# EAGLE design CANBUS_USB_TEENSY_41 (EAGLE 9.7.0)
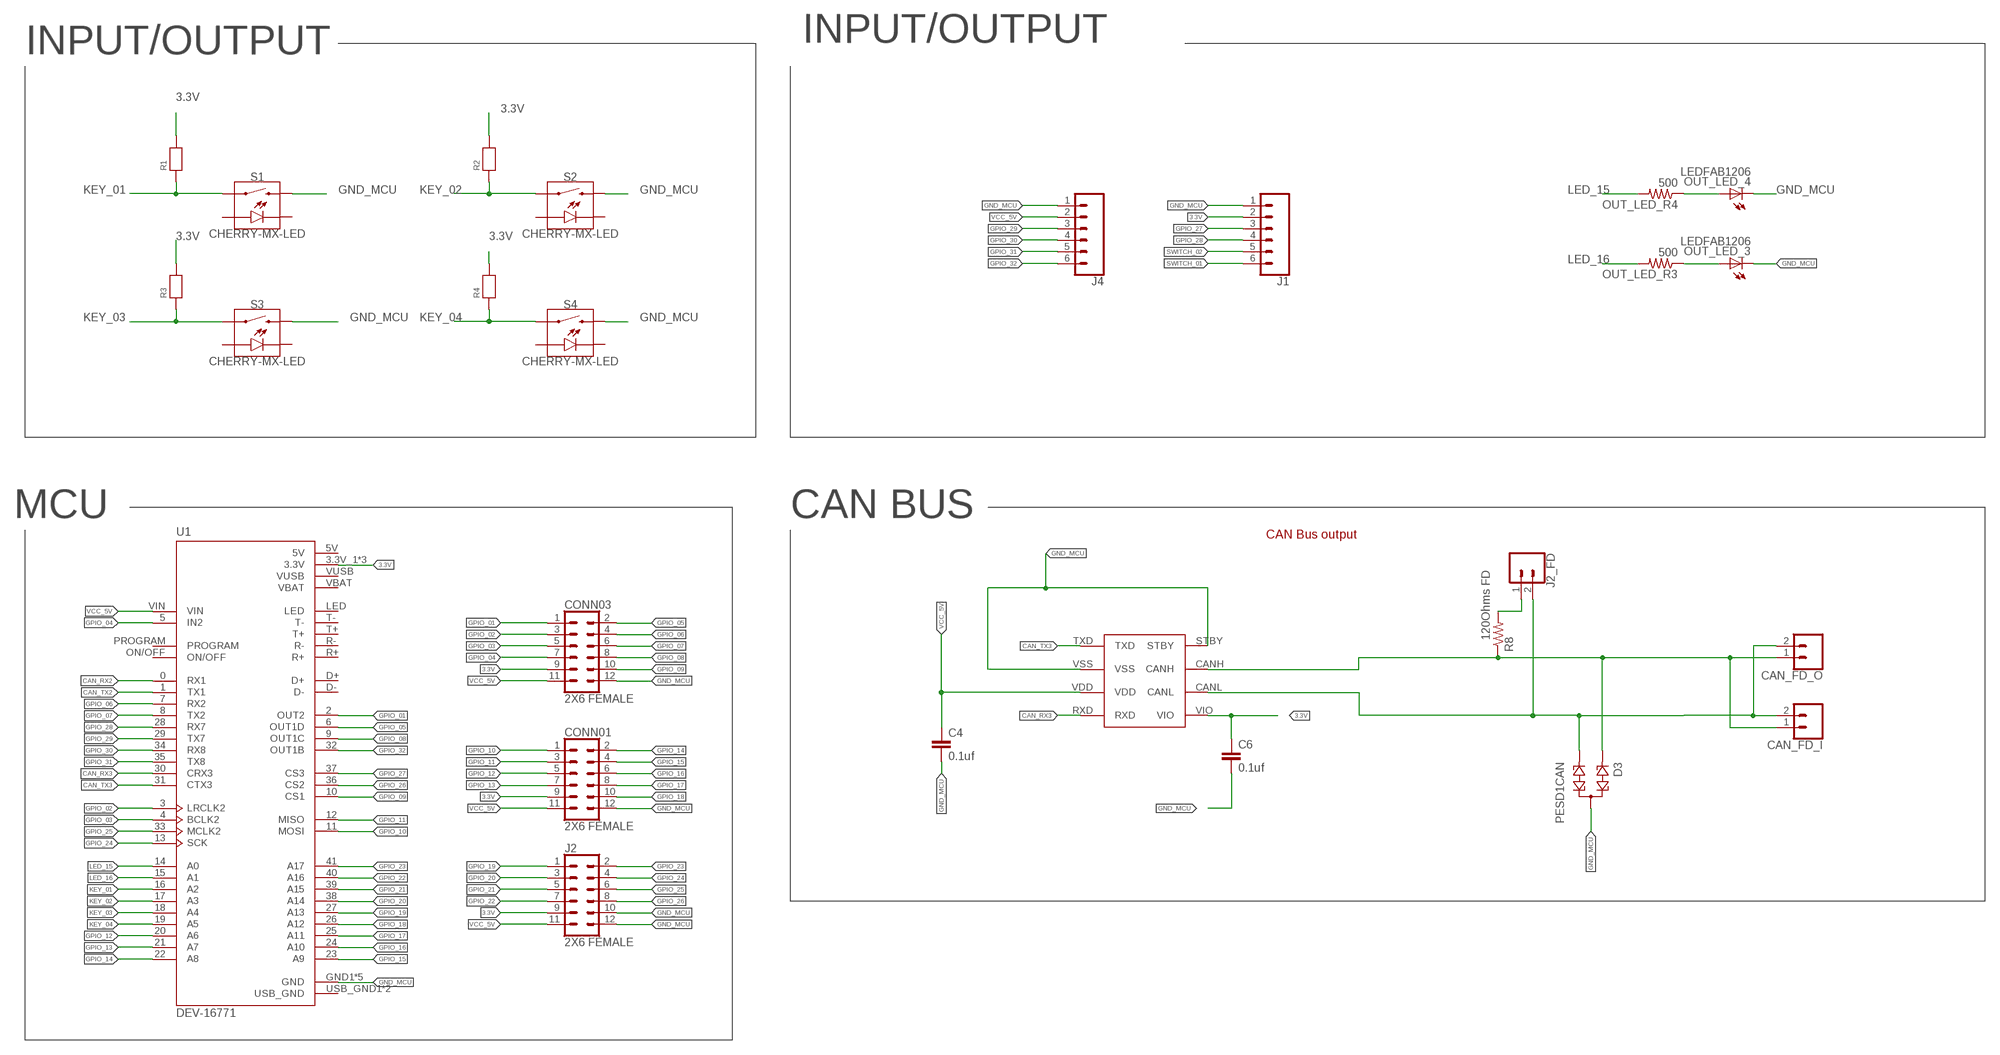
[diagram p0: schematic, sheet 1, part 1 of 2]
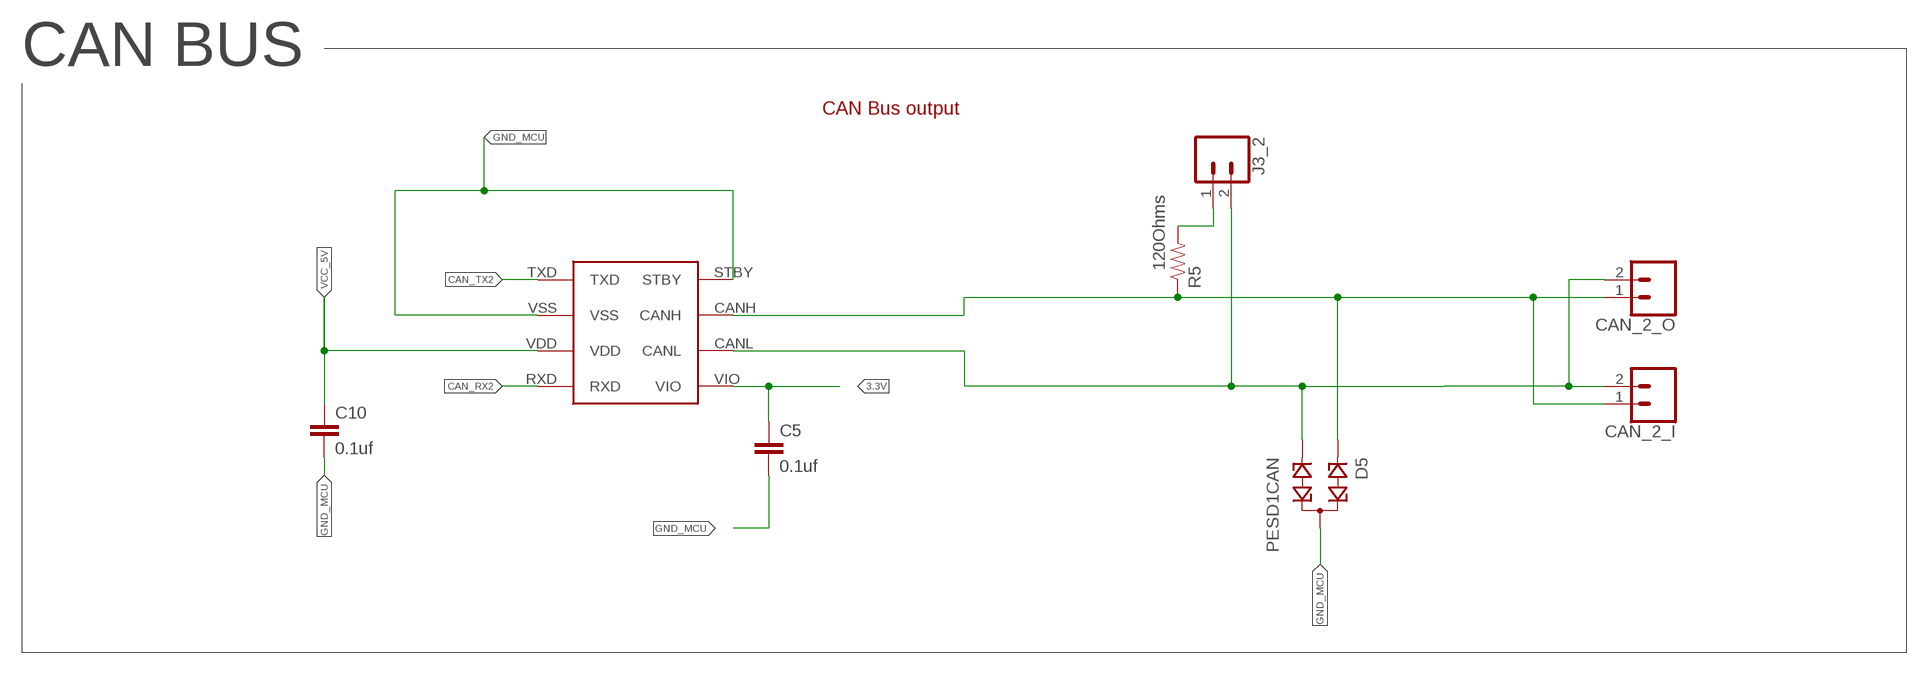
[diagram p1: schematic, sheet 1, part 2 of 2]

## Parts
C4  0.1uf  0.1UF-25V(+80/-20%)(0603)  [0603-CAP]
C5  0.1uf  0.1UF-25V(+80/-20%)(0603)  [0603-CAP]
C6  0.1uf  0.1UF-25V(+80/-20%)(0603)  [0603-CAP]
C10  0.1uf  0.1UF-25V(+80/-20%)(0603)  [0603-CAP]
CAN_2_I  CONN_02-JST-2MM-SMT  [JST-2-SMD]
CAN_2_O  CONN_02-JST-2MM-SMT  [JST-2-SMD]
CAN_FD_I  CONN_02-JST-2MM-SMT  [JST-2-SMD]
CAN_FD_O  CONN_02-JST-2MM-SMT  [JST-2-SMD]
CONN01  2X6 FEMALE  CONN_06X2PTH_FEMALE  [2X6]
CONN03  2X6 FEMALE  CONN_06X2PTH_FEMALE  [2X6]
D3  PESD1CAN  [SOT23]
D5  PESD1CAN  [SOT23]
J1  CONN_06SMD-1MM  [1X06-1MM]
J2  2X6 FEMALE  CONN_06X2PTH_FEMALE  [2X6]
J2_FD  CONN_02  [1X02]
J3_2  CONN_02  [1X02]
J4  CONN_06SMD-1MM  [1X06-1MM]
MCP2562  MCP2562  [MCP2562]
MCP2562FD  MCP2562  [MCP2562]
OUT_LED_3  LEDFAB1206  [LED1206FAB]
OUT_LED_4  LEDFAB1206  [LED1206FAB]
OUT_LED_R3  500  RES-US1206FAB  [R1206FAB]
OUT_LED_R4  500  RES-US1206FAB  [R1206FAB]
R1  RESISTOR1206  [1206]
R2  RESISTOR1206  [1206]
R3  RESISTOR1206  [1206]
R4  RESISTOR1206  [1206]
R5  120Ohms  10KOHM-1/10W-1%(0603)0603  [0603-RES]
R8  120Ohms FD  10KOHM-1/10W-1%(0603)0603  [0603-RES]
S1  CHERRY-MX-LED  [CHERRY-MX-LED]
S2  CHERRY-MX-LED  [CHERRY-MX-LED]
S3  CHERRY-MX-LED  [CHERRY-MX-LED]
S4  CHERRY-MX-LED  [CHERRY-MX-LED]
U1  DEV-16771  [MODULE_DEV-16771]

## Nets
3.3V: C5.1 C6.1 CONN01.9 CONN03.9 J1.2 J2.9 MCP2562.VIO MCP2562FD.VIO R1.2 R2.2 R3.2 R4.2 U1.3.3V_1(3.3V) U1.3.3V_2(3.3V) U1.3.3V_3(3.3V)
CAN_H: CAN_FD_I.1 CAN_FD_O.1 D3.1 MCP2562FD.CANH R8.1
CAN_H1: CAN_2_I.1 CAN_2_O.1 D5.1 MCP2562.CANH R5.1
CAN_L: CAN_FD_I.2 CAN_FD_O.2 D3.2 J2_FD.2 MCP2562FD.CANL
CAN_L1: CAN_2_I.2 CAN_2_O.2 D5.2 J3_2.2 MCP2562.CANL
CAN_RX2: MCP2562.RXD U1.0(RX1)
CAN_RX3: MCP2562FD.RXD U1.30(CRX3)
CAN_TX2: MCP2562.TXD U1.1(TX1)
CAN_TX3: MCP2562FD.TXD U1.31(CTX3)
GND_MCU: C4.2 C5.2 C6.2 C10.2 CONN01.12 CONN03.12 D3.3 D5.3 J1.1 J2.10 J2.12 J4.1 MCP2562.STBY MCP2562.VSS MCP2562FD.STBY MCP2562FD.VSS OUT_LED_3.2(C) OUT_LED_4.2(C) S1.S2 S2.S2 S3.S2 S4.S2 U1.GND1(GND) U1.GND2(GND) U1.GND3(GND) U1.GND4(GND) U1.GND5(GND)
GPIO_01: CONN03.1 U1.2(OUT2)
GPIO_02: CONN03.3 U1.3(LRCLK2)
GPIO_03: CONN03.5 U1.4(BCLK2)
GPIO_04: CONN03.7 U1.5(IN2)
GPIO_05: CONN03.2 U1.6(OUT1D)
GPIO_06: CONN03.4 U1.7(RX2)
GPIO_07: CONN03.6 U1.8(TX2)
GPIO_08: CONN03.8 U1.9(OUT1C)
GPIO_09: CONN03.10 U1.10(CS1)
GPIO_10: CONN01.1 U1.11(MOSI)
GPIO_11: CONN01.3 U1.12(MISO)
GPIO_12: CONN01.5 U1.20(A6)
GPIO_13: CONN01.7 U1.21(A7)
GPIO_14: CONN01.2 U1.22(A8)
GPIO_15: CONN01.4 U1.23(A9)
GPIO_16: CONN01.6 U1.24(A10)
GPIO_17: CONN01.8 U1.25(A11)
GPIO_18: CONN01.10 U1.26(A12)
GPIO_19: J2.1 U1.27(A13)
GPIO_20: J2.3 U1.38(A14)
GPIO_21: J2.5 U1.39(A15)
GPIO_22: J2.7 U1.40(A16)
GPIO_23: J2.2 U1.41(A17)
GPIO_24: J2.4 U1.13(SCK)
GPIO_25: J2.6 U1.33(MCLK2)
GPIO_26: J2.8 U1.36(CS2)
GPIO_27: J1.3 U1.37(CS3)
GPIO_28: J1.4 U1.28(RX7)
GPIO_29: J4.3 U1.29(TX7)
GPIO_30: J4.4 U1.34(RX8)
GPIO_31: J4.5 U1.35(TX8)
GPIO_32: J4.6 U1.32(OUT1B)
KEY_01: R1.1 S1.S1 U1.16(A2)
KEY_02: R2.1 S2.S1 U1.17(A3)
KEY_03: R3.1 S3.S1 U1.18(A4)
KEY_04: R4.1 S4.S1 U1.19(A5)
LED_15: OUT_LED_R4.2 U1.14(A0)
LED_16: OUT_LED_R3.2 U1.15(A1)
N$2: J2_FD.1 R8.2
N$5: J3_2.1 R5.2
N$6: OUT_LED_3.1(A) OUT_LED_R3.1
N$7: OUT_LED_4.1(A) OUT_LED_R4.1
SWITCH_01: J1.6
SWITCH_02: J1.5
VCC_5V [vcc5]: C4.1 C10.1 CONN01.11 CONN03.11 J2.11 J4.2 MCP2562.VDD MCP2562FD.VDD U1.VIN
Unconnected: S1.A S1.K(C) S2.A S2.K(C) S3.A S3.K(C) S4.A S4.K(C) U1.D+ U1.D- U1.LED U1.ON/OFF U1.PROGRAM U1.R+ U1.R- U1.T+ U1.T- U1.VBAT U1.VUSB

## Notes on the sheet
- INPUT/OUTPUT | INPUT/OUTPUT
- MCU | CAN BUS | CAN BUS
- CAN Bus output
- CAN Bus output

## Power pins joined to a net without a drawn wire
5V: U1.5V
USB_GND: U1.USB_GND1(USB_GND) U1.USB_GND2(USB_GND)

## Library data of the parts
C4-C6 C10 = SparkFun-Capacitors:0.1UF-25V(+80/-20%)(0603): CAP-00810 Ceramic Standard decoupling cap; PROD_ID: CAP-00810; VALUE: 0.1uF
CAN_2_I CAN_2_O CAN_FD_I CAN_FD_O = SparkFun-Connectors:CONN_02: Multi connection point. Often used as Generic Header-pin footprint for 0.1 inch spaced/style header connections On any of the 0.1 inch spaced packages, you can populate with these: Break Away Headers - Straight <https://www.sparkfun.com/products/116> (PRT-00116) Break Away Male Headers - Right Angle <https://www.sparkfun.com/products/553> (PRT-00553) Female Headers <https://www.sparkfun.com/products/115> (PRT-00115) Break Away Headers - Machine Pin <https://www.sparkfun.com/products/117> (PRT-00117) Break Away Female Headers - Swiss Machine Pin <https://www.sparkfun.com/products/743> (PRT-00743) For SCREWTERMINALS and SPRING TERMINALS visit here: Screw Terimnals on SparkFun.com <https://www.sparkfun.com/search/results?term=Screw+Terminals> (5mm/3.5mm/2.54mm spacing) This device is also useful as a general connection point to wire up your design to another part of your project. Our various solder wires solder well into these plated through hole pads. Hook-Up Wire - Assortment (Stranded, 22 AWG) <https://www.sparkfun.com/products/11375> (PRT-11375) Hook-Up Wire - Assortment (Solid Core, 22 AWG) <https://www.sparkfun.com/products/11367> (PRT-11367) View the entire wire category on our website here <https://www.sparkfun.com/categories/141> Special notes: Molex polarized connector foot print use with: PRT-08233 with associated crimp pins and housings. 2.54_SCREWTERM for use with PRT-10571. 3.5mm Screw Terminal footprints for PRT-08084 5mm Screw Terminal footprints for use with PRT-08432; PROD_ID: CONN-11443
CONN01 CONN03 J2 = SparkFun-Connectors:CONN_06X2: Multi connection point. Often used as Generic Header-pin footprint for 0.1 inch spaced/style header connections On any of the 0.1 inch spaced packages, you can populate with these: Break Away Headers - Straight <https://www.sparkfun.com/products/116> (PRT-00116) Break Away Male Headers - Right Angle <https://www.sparkfun.com/products/553> (PRT-00553) Female Headers <https://www.sparkfun.com/products/115> (PRT-00115) Break Away Headers - Machine Pin <https://www.sparkfun.com/products/117> (PRT-00117) Break Away Female Headers - Swiss Machine Pin <https://www.sparkfun.com/products/743> (PRT-00743); PROD_ID: CONN-12423
D3 D5 = diode:PESD1CAN: CAN bus ESD protection diode Source: http://www.nxp.com/documents/data_sheet/PESD1CAN.pdf
J1 J4 = SparkFun-Connectors:CONN_06: Multi connection point. Often used as Generic Header-pin footprint for 0.1 inch spaced/style header connections On any of the 0.1 inch spaced packages, you can populate with these: Break Away Headers - Straight <https://www.sparkfun.com/products/116> (PRT-00116) Break Away Male Headers - Right Angle <https://www.sparkfun.com/products/553> (PRT-00553) Female Headers <https://www.sparkfun.com/products/115> (PRT-00115) Break Away Headers - Machine Pin <https://www.sparkfun.com/products/117> (PRT-00117) Break Away Female Headers - Swiss Machine Pin <https://www.sparkfun.com/products/743> (PRT-00743) Arduino Stackable Header - 6 Pin <https://www.sparkfun.com/products/9280> (PRT-09280) For SCREWTERMINALS and SPRING TERMINALS visit here: Screw Terimnals on SparkFun.com <https://www.sparkfun.com/search/results?term=Screw+Terminals> (5mm/3.5mm/2.54mm spacing) This device is also useful as a general connection point to wire up your design to another part of your project. Our various solder wires solder well into these plated through hole pads. Hook-Up Wire - Assortment (Stranded, 22 AWG) <https://www.sparkfun.com/products/11375> (PRT-11375) Hook-Up Wire - Assortment (Solid Core, 22 AWG) <https://www.sparkfun.com/products/11367> (PRT-11367) View the entire wire category on our website here <https://www.sparkfun.com/categories/141>; PROD_ID: CONN-08249; SF_ID: GPS-00579
J2_FD J3_2 = SparkFun-Connectors:CONN_02: Multi connection point. Often used as Generic Header-pin footprint for 0.1 inch spaced/style header connections On any of the 0.1 inch spaced packages, you can populate with these: Break Away Headers - Straight <https://www.sparkfun.com/products/116> (PRT-00116) Break Away Male Headers - Right Angle <https://www.sparkfun.com/products/553> (PRT-00553) Female Headers <https://www.sparkfun.com/products/115> (PRT-00115) Break Away Headers - Machine Pin <https://www.sparkfun.com/products/117> (PRT-00117) Break Away Female Headers - Swiss Machine Pin <https://www.sparkfun.com/products/743> (PRT-00743) For SCREWTERMINALS and SPRING TERMINALS visit here: Screw Terimnals on SparkFun.com <https://www.sparkfun.com/search/results?term=Screw+Terminals> (5mm/3.5mm/2.54mm spacing) This device is also useful as a general connection point to wire up your design to another part of your project. Our various solder wires solder well into these plated through hole pads. Hook-Up Wire - Assortment (Stranded, 22 AWG) <https://www.sparkfun.com/products/11375> (PRT-11375) Hook-Up Wire - Assortment (Solid Core, 22 AWG) <https://www.sparkfun.com/products/11367> (PRT-11367) View the entire wire category on our website here <https://www.sparkfun.com/categories/141> Special notes: Molex polarized connector foot print use with: PRT-08233 with associated crimp pins and housings. 2.54_SCREWTERM for use with PRT-10571. 3.5mm Screw Terminal footprints for PRT-08084 5mm Screw Terminal footprints for use with PRT-08432
MCP2562 MCP2562FD = MCP2562:MCP2562
OUT_LED_3 OUT_LED_4 = fab:LED: LED
OUT_LED_R3 OUT_LED_R4 = fab:RES-US: Resistor (US Symbol) Variants with postfix FAB are widened to allow the routing of internal traces
R1-R4 = microbuilder:RESISTOR: Resistors 0402 - 0402 Surface Mount Package 22 Ohm 1% 1/16W [Digikey: 311-22.0LRTR-ND] 33 Ohm 5% 1/16W 1.0K 5% 1/16W 1.5K 5% 1/16W 2.0K 1% 1/16W 10.0K 1% 1/16W [Digikey: 311-10.0KLRTR-ND] 10.0K 5% 1/16W [Digikey: RMCF0402JT10K0TR-ND] 12.1K 1% 1/16W [Digikey: 311-22.0LRTR-ND] 100.0K 5% 1/16W 0603 - 0603 Surface Mount Package 0 Ohm 1/10 Watt 1% Resistor 15 Ohm 1/10 Watt 1% Resistor 33 Ohm 1/10 Watt 1% Resistor 49.9 Ohm 1/10 Watt 1% Resistor 100 Ohm 1/10 Watt 1% Resistor 150 Ohm 1/10 Watt 1% Resistor 240 Ohm 1/10 Watt 1% Resistor 390 Ohm 1/10 Watt 1% Resistor 560 Ohm 1/10 Watt 1% Resistor 680 Ohm 1/10 Watt 1% Resistor 750 Ohm 1/10 Watt 1% Resistor 1.0K Ohm 1/10 Watt 1% Resistor 1.5K Ohm 1/10 Watt 1% Resistor 2.0K Ohm 1/10 Watt 1% Resistor 2.2K Ohm 1/10 Watt 1% Resistor 3.3K Ohm 1/10 Watt 1% Resistor 4.7K Ohm 1/10 Watt 1% Resistor 10.0K Ohm 1/10 Watt 1% Resistor 12.0K Ohm 1/10 Watt 1% Resistor 12.1K Ohm 1/10 Watt 1% Resistor 20.0K Ohm 1/10 Watt 1% Resistor 33.0K Ohm 1/10 Watt 1% Resistor 100.0K Ohm 1/10 Watt 1% Resistor 0805 - 0805 Surface Mount Package 0 Ohm 1/8 Watt 1% Resistor 33 Ohm 1/8 Watt 1% Resistor 100 Ohm 1/8 Watt 1% Resistor 150 Ohm 1/8 Watt 1% Resistor 200 Ohm 1/8 Watt 1% Resistor 240 Ohm 1/8 Watt 1% Resistor 330 Ohm 1/8 Watt 1% Resistor 390 Ohm 1/8 Watt 1% Resistor 470 Ohm 1/8 Watt 1% Resistor 1.0K Ohm 1/8 Watt 1% Resistor 1.5K Ohm 1/8 Watt 1% Resistor 2.0K Ohm 1/8 Watt 1% Resistor 4.7K Ohm 1/8 Watt 1% Resistor 5.1K Ohm 1/8 Watt 1% Resistor 5.6K Ohm 1/8 Watt 1% Resistor 10.0K Ohm 1/8 Watt 1% Resistor 22.0K Ohm 1/8 Watt 1% Resistor 33.0K Ohm 1/8 Watt 1% Resistor 100K Ohm 1/8 Watt 1% Resistor 1206 - 1206 Surface Mount Package 2012 - 2010 Surface Mount Package 0.11 Ohm 1/2 Watt 1% Resistor - Digikey: RHM.11UCT-ND
R5 R8 = SparkFun-Resistors:10KOHM-1/10W-1%(0603): RES-00824; PROD_ID: RES-00824; VALUE: 10K
S1-S4 = cherry-temp:CHERRY-MX-LED
U1 = DEV-16771:DEV-16771: RT1062 Teensy 4.1 i.MX ARM Cortex-M7 MPU Embedded Evaluation Board Check availability <https://pricing.snapeda.com/parts/DEV-16771/SparkFun%20Electronics/view-part?ref=eda>; AVAILABILITY: In Stock; DESCRIPTION: RT1062 Teensy 4.1 series ARM® Cortex®-M7 MPU Embedded Evaluation Board; MF: SparkFun Electronics; MP: DEV-16771; PACKAGE: None; PRICE: None; PURCHASE-URL: https://pricing.snapeda.com/search?q=DEV-16771&ref=eda

## Net classes
0 default: width 0.2 mm, clearance 0.2 mm
1 gnd: width 0.2 mm, clearance 0.2 mm
3 vcc: width 0.35 mm, clearance 0.2 mm
4 vcc5: width 0.35 mm, clearance 0.2 mm

## Board
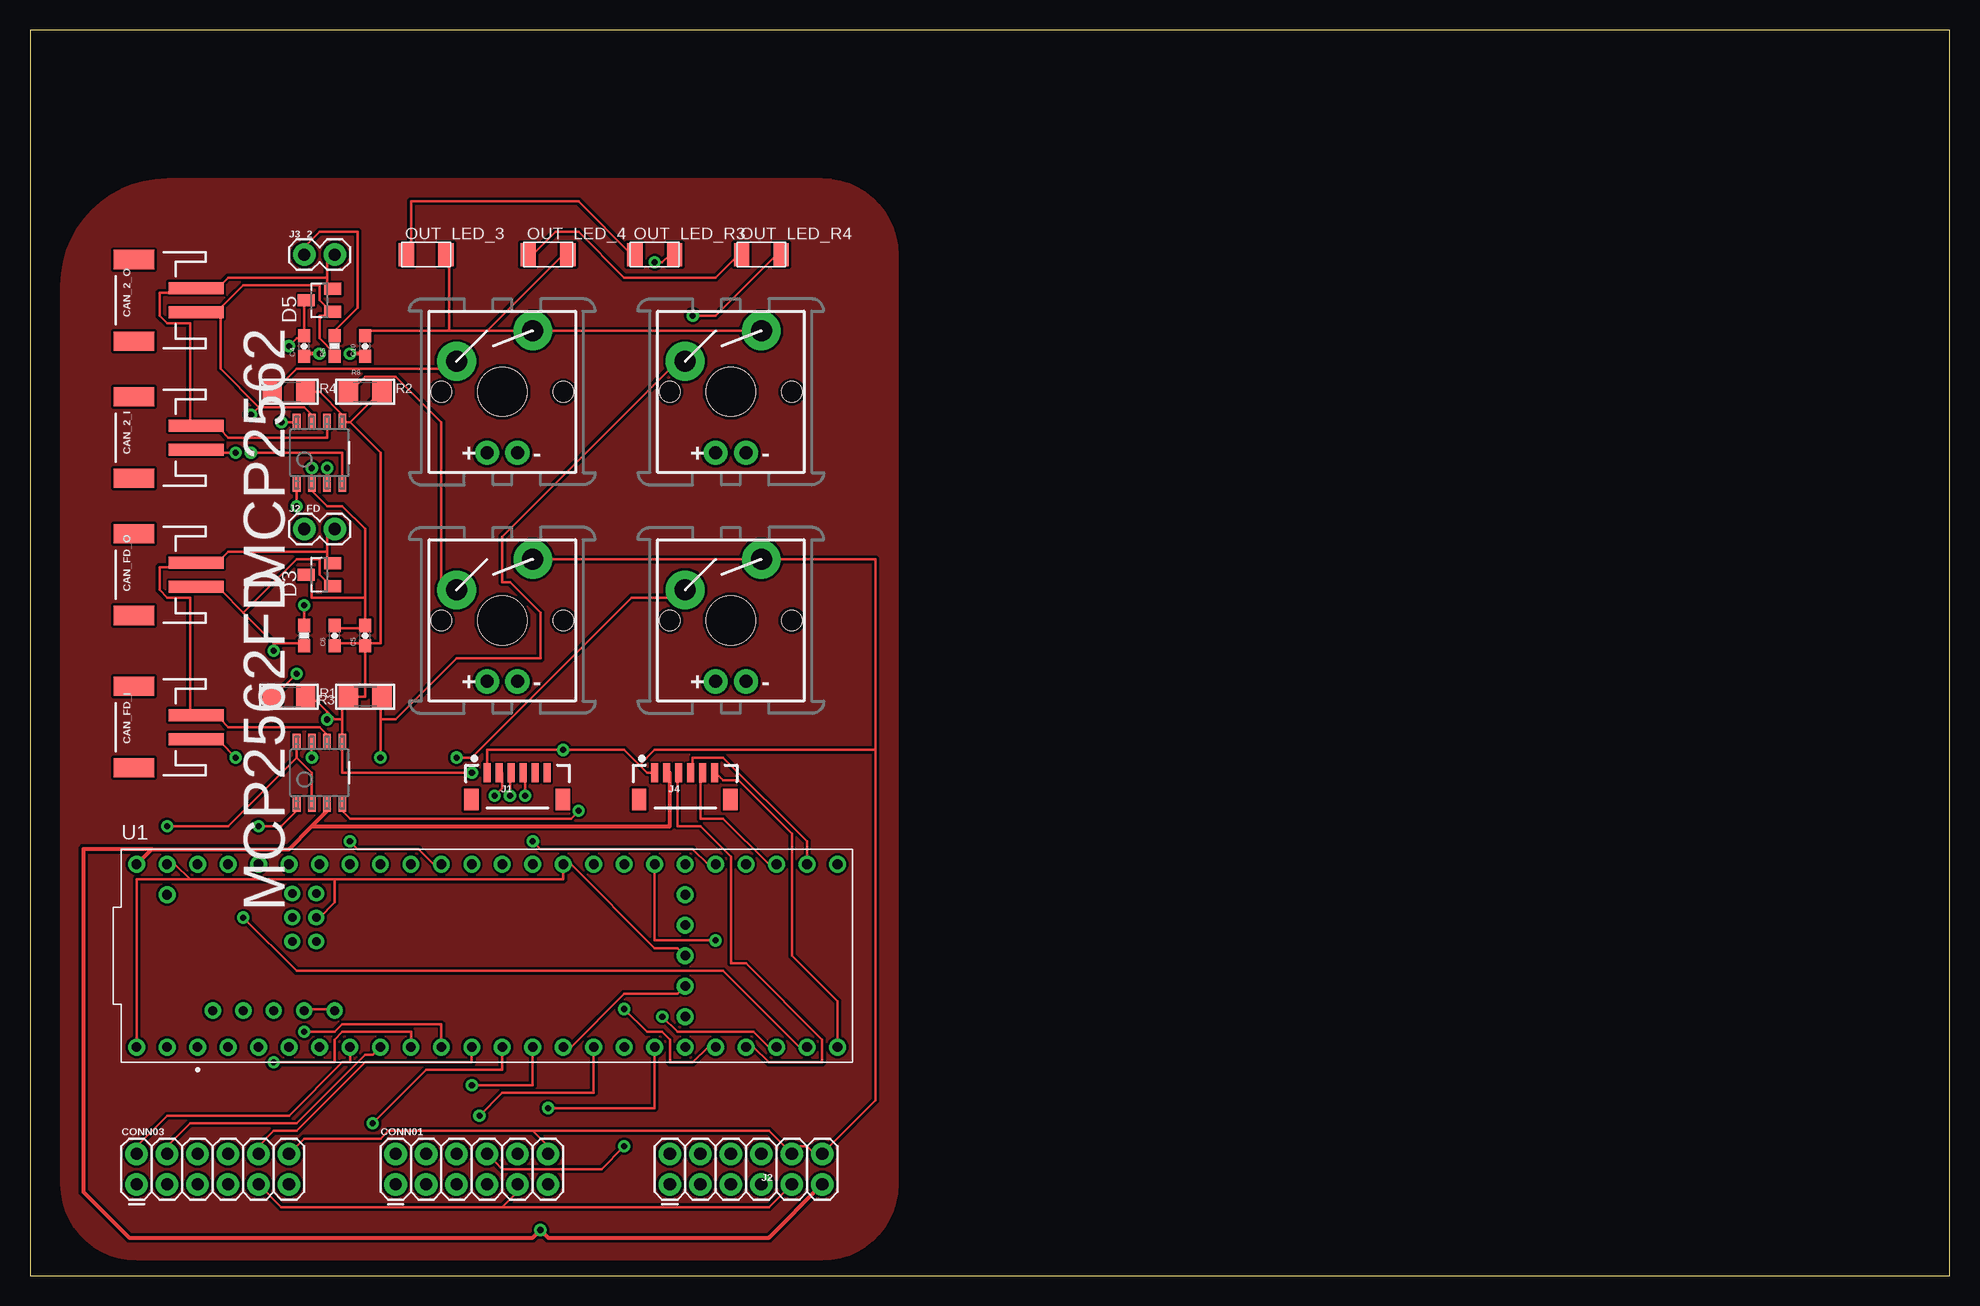
[diagram p2: board, top side]
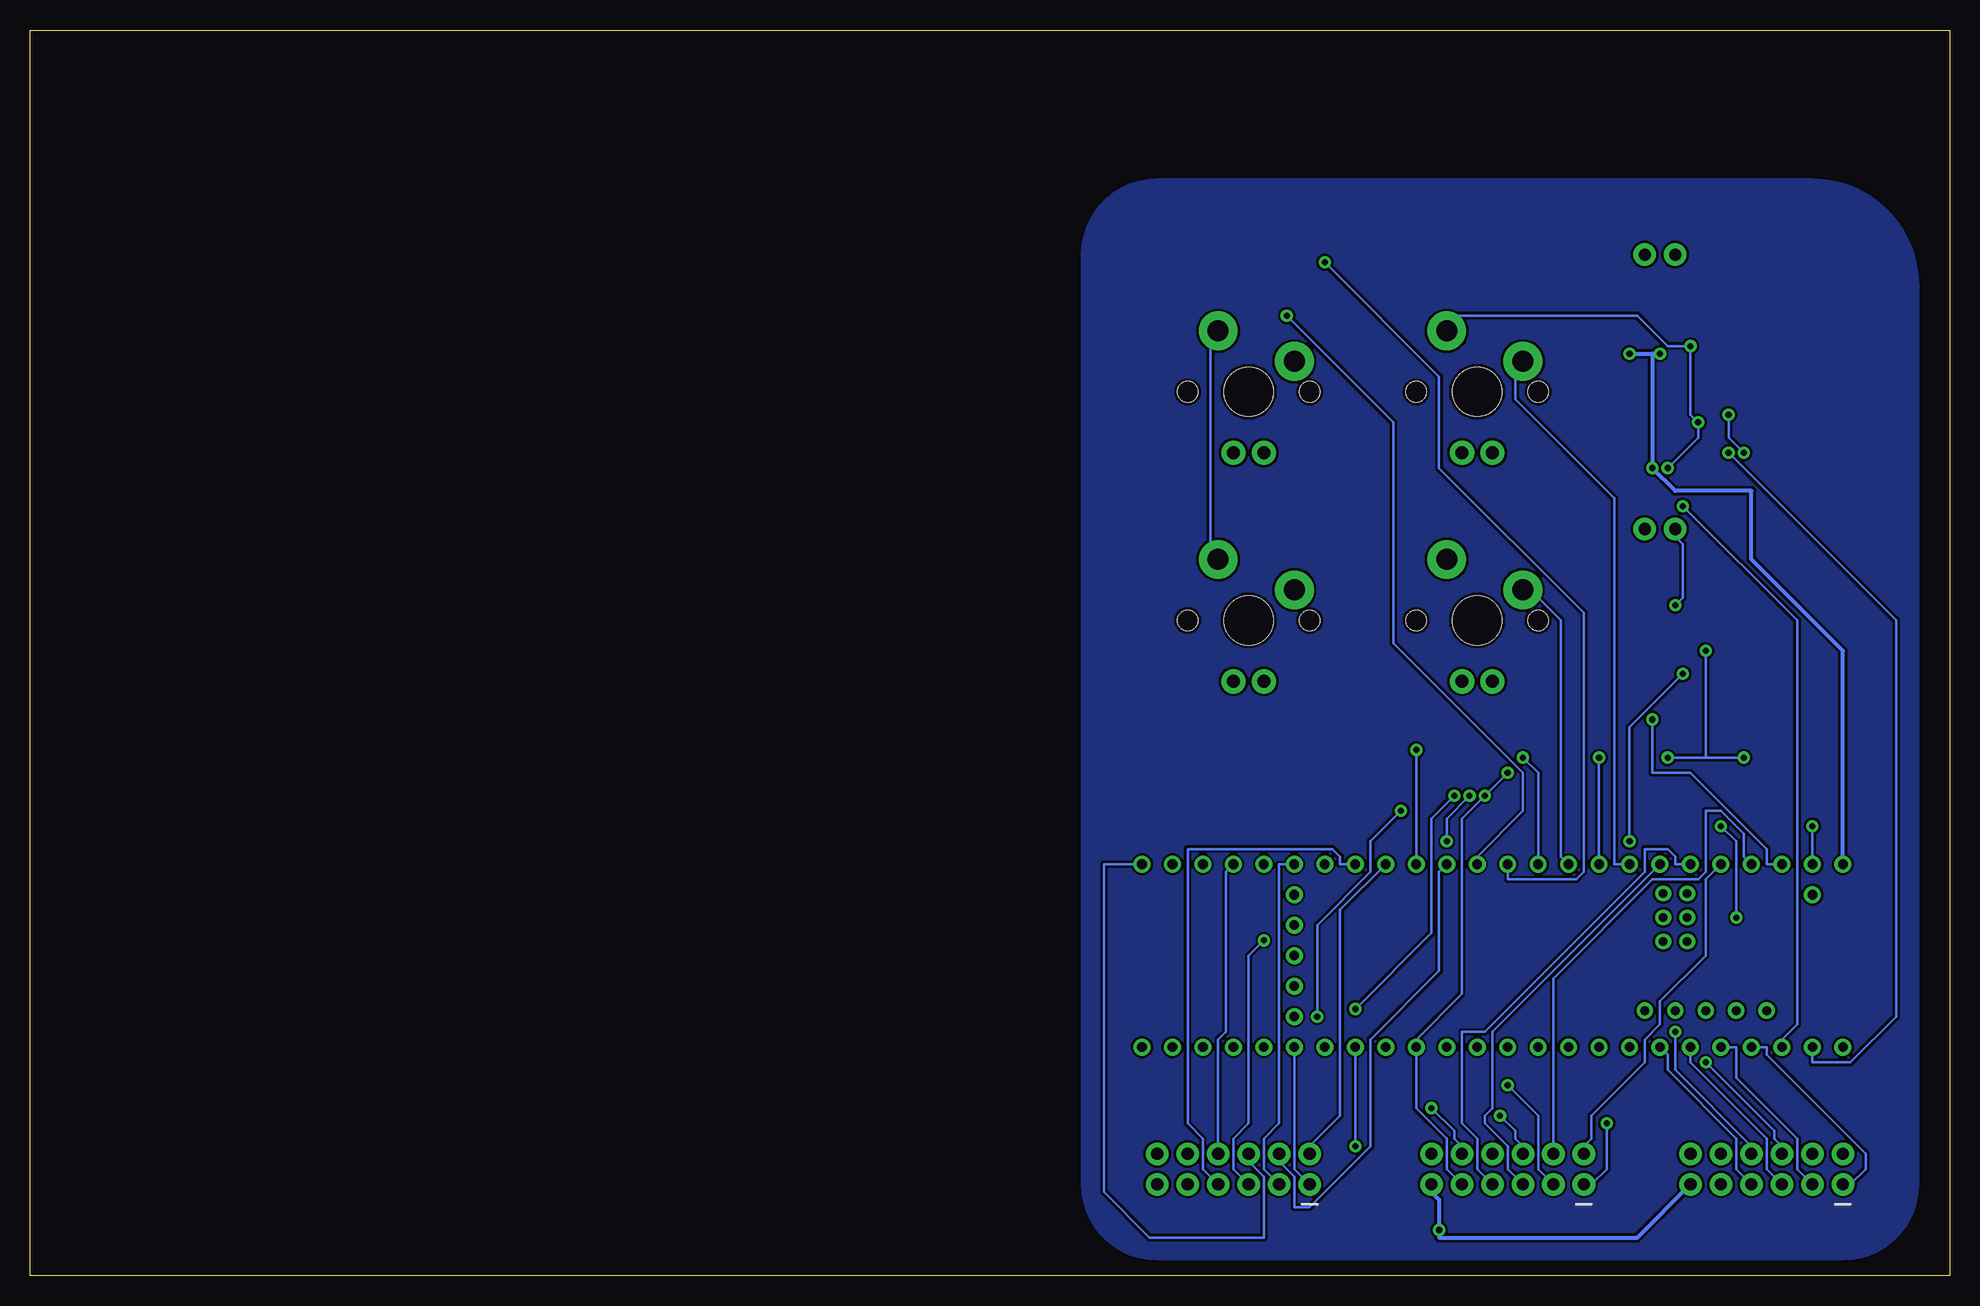
[diagram p3: board, bottom side, seen from below]

Size 160 x 103.81 mm. Coordinates in mm from the lower left corner, seen from the top.
Outline: 0,0 160,0 160,103.81 0,103.81 0,0
Copper layers (1*16): Top / Bottom
Stack-up Default Layer Stack: Top User Defined 0.035mm / Dielectric-1 User Defined 1.5mm / Bottom User Defined 0.035mm
Design rules "SparkFun": minimum track width 8mil, minimum drill 20mil, track to track 8mil, track to pad 8mil, pad to pad 8mil, via to via 8mil, smd to smd 8mil, copper to edge 10mil, drill to drill 8mil, minimum pad ring 12mil, minimum via ring 10mil, stop-mask expansion 4mil, vias tented up to drill 25mil, thermal gap 10mil

### Footprints (pad centres in the part's own frame; a part is rotated, then mirrored left to right if it is on the bottom)
0603-CAP = smd 1.1 x 1: 1 -0.85,0; 2 0.85,0
JST-2-SMD = smd 1 x 4.6: 1 -1,-3.7; 2 1,-3.7 | smd 1.6 x 3.4: NC1 -3.4,1.5; NC2 3.4,1.5
2X6 = drill 1.016 pad 1.88: 1 0,0; 2 0,2.54; 3 2.54,0; 4 2.54,2.54; 5 5.08,0; 6 5.08,2.54; 7 7.62,0; 8 7.62,2.54; 9 10.16,0; 10 10.16,2.54; 11 12.7,0; 12 12.7,2.54
SOT23 = smd 1 x 1.4: 1 -0.95,-1.1; 2 0.95,-1.1; 3 0,1.1
1X06-1MM = smd 0.6 x 1.55: 1 -2.54,1.27; 2 -1.54,1.27; 3 -0.54,1.27; 4 0.46,1.27; 5 1.46,1.27; 6 2.46,1.27 | smd 1.2 x 1.8: P$1 -3.84,-0.955; P$2 3.76,-0.955
1X02 = drill 1.016 pad 1.88: 1 0,0; 2 2.54,0
MCP2562 = smd 1.27 x 0.635: CANH 2.625,0.635; CANL 2.625,-0.635; RXD -2.625,-1.905; STBY 2.625,1.905; TXD -2.625,1.905; VDD -2.625,-0.635; VIO 2.625,-1.905; VSS -2.625,0.635
LED1206FAB = smd 1.27 x 1.905: 1 -1.651,0; 2 1.651,0
R1206FAB = smd 1.27 x 1.905: 1 -1.651,0; 2 1.651,0
1206 = smd 1.6 x 1.8: 1 -1.4,0; 2 1.4,0
0603-RES = smd 1.1 x 1: 1 -0.85,0; 2 0.85,0
CHERRY-MX-LED = drill 1.092 pad 2.032: A -1.27,-5.08; K 1.27,-5.08 | drill 1.753 pad 3.226: S1 -3.81,2.54; S2 2.54,5.08 | hole 4.089: 0,0 | hole 1.707: -5.08,0; 5.08,0
MODULE_DEV-16771 = drill 0.8: 0 -26.67,-7.62; 1 -24.13,-7.62; 2 -21.59,-7.62; 3 -19.05,-7.62; 3.3V_1 6.35,-7.62; 3.3V_2 -24.13,7.62; 3.3V_3 16.51,-2.54; 4 -16.51,-7.62; 5 -13.97,-7.62; 6 -11.43,-7.62; 7 -8.89,-7.62; 8 -6.35,-7.62; 9 -3.81,-7.62; 10 -1.27,-7.62; 11 1.27,-7.62; 12 3.81,-7.62; 13 3.81,7.62; 14 1.27,7.62; 15 -1.27,7.62; 16 -3.81,7.62; 17 -6.35,7.62; 18 -8.89,7.62; 19 -11.43,7.62; 20 -13.97,7.62; 21 -16.51,7.62; 22 -19.05,7.62; 23 -21.59,7.62; 24 8.89,-7.62; 25 11.43,-7.62; 26 13.97,-7.62; 27 16.51,-7.62; 28 19.05,-7.62; 29 21.59,-7.62; 30 24.13,-7.62; 31 26.67,-7.62; 32 29.21,-7.62; 33 29.21,7.62; 34 26.67,7.62; 35 24.13,7.62; 36 21.59,7.62; 37 19.05,7.62; 38 16.51,7.62; 39 13.97,7.62; 40 11.43,7.62; 41 8.89,7.62; GND1 -29.21,-7.62; GND2 6.35,7.62; GND3 -26.67,7.62; GND4 16.51,0; ON/OFF 16.51,5.08; PROGRAM 16.51,2.54; VBAT 16.51,-5.08; VIN -29.21,7.62; VUSB -26.67,5.08 | drill 0.75: 5V -22.86,-4.57; D+ -17.78,-4.57; D- -20.32,-4.57; USB_GND1 -15.24,-4.57; USB_GND2 -12.7,-4.57 | drill 0.7: GND5 -14.24,3.17; LED -16.24,3.17; R+ -16.24,5.17; R- -14.24,5.17; T+ -14.24,1.17; T- -16.24,1.17

### Placement (x,y rotation side)
C4  22.86,77.47 90 top
C5  27.94,53.34 90 top
C6  25.4,53.34 90 top
C10  27.94,77.47 90 top
CAN_2_I  10.16,69.85 90 top
CAN_2_O  10.16,81.28 90 top
CAN_FD_I  10.16,45.72 90 top
CAN_FD_O  10.16,58.42 90 top
CONN01  30.48,7.62 0 top
CONN03  8.89,7.62 0 top
D3  24.13,58.42 90 top
D5  24.13,81.28 90 top
J1  40.64,40.64 0 top
J2  53.34,7.62 0 top
J2_FD  22.86,62.23 0 top
J3_2  22.86,85.09 0 top
J4  54.61,40.64 0 top
MCP2562  24.13,68.58 90 top
MCP2562FD  24.13,41.91 90 top
OUT_LED_3  33.02,85.09 0 top
OUT_LED_4  43.18,85.09 0 top
OUT_LED_R3  52.07,85.09 0 top
OUT_LED_R4  60.96,85.09 0 top
R1  21.59,48.26 0 top
R2  27.94,73.66 0 top
R3  27.94,48.26 180 top
R4  21.59,73.66 0 top
R5  25.4,77.47 90 top
R8  22.86,53.34 90 top
S1  58.42,54.61 0 top
S2  39.37,54.61 0 top
S3  58.42,73.66 0 top
S4  39.37,73.66 0 top
U1  38.1,26.67 0 top

### Tracks (layer width: path | path; a pad name or v marks a point on that pad's centre or on a via)
3.3V  (via drill 0.51)
  Top 0.203: R4.2 23.49,73.66 24.13,73.66 26.04,71.76 MCP2562.VIO 26.04,71.12 26.67,71.12 | 26.67,71.12 29.21,73.66 R2.2 | 27.94,52.7 25.4,52.7 C6.1 | 27.94,52.7 C5.1 | 26.04,46.35 26.04,48.26 R3.2 26.67,48.26 27.94,48.26 27.94,52.07 C5.1 | 26.04,46.35 26.04,45.09 MCP2562FD.VIO 26.04,44.45 26.04,41.91 v36.83,41.91 | 24.76,46.99 25.4,46.35 26.04,46.35 | 24.76,46.99 23.49,48.26 R1.2 | 24.76,46.99 v24.76,46.35 | 26.67,71.12 29.21,68.58 29.21,52.7 27.94,52.7 | 27.94,52.7 C5.1 | v38.73,40.01 39.37,40.64 39.37,41.91 J1.2 | U1.3.3V_3 53.98,23.49 49.53,23.49 45.09,19.05 U1.3.3V_1 | CONN03.9 20.95,5.71 39.37,5.71 | 39.37,5.71 40.64,6.99 CONN01.9 | J2.9 61.59,5.71 39.37,5.71
  Bottom 0.203: U1.3.3V_2 15.24,34.29 15.24,35.56 21.59,41.91 24.76,41.91 v24.76,46.35 | CONN01.9 40.64,8.25 41.28,8.25 41.91,8.89 41.91,11.43 44.45,13.97 U1.3.3V_1 44.45,19.68 40.64,23.49 40.64,38.1 v38.73,40.01 v36.83,41.91
CAN_H  (via drill 0.51)
  Top 0.203: v23.49,43.18 23.49,44.45 MCP2562FD.CANH | v17.14,43.18 15.88,44.45 13.97,44.45 CAN_FD_I.1 | 20.32,52.7 22.86,52.7 R8.1 | 17.78,55.24 15.88,57.15 13.97,57.15 CAN_FD_O.1 | 17.78,55.24 20.32,52.7 | 17.78,55.24 22.22,59.69 24.13,59.69 24.13,58.42 24.76,57.78 D3.1 | 20.32,52.7 v20.32,52.07
  Bottom 0.203: v17.14,43.18 20.32,43.18 | 20.32,43.18 v23.49,43.18 | v20.32,52.07 20.32,43.18
CAN_H1  (via drill 0.51)
  Top 0.203: R5.1 25.4,76.84 24.13,78.11 24.13,80.01 24.76,80.01 D5.1 24.76,80.65 24.13,81.28 24.13,82.55 17.78,82.55 15.24,80.01 | 19.05,72.39 22.86,72.39 23.49,71.76 MCP2562.CANH | 19.05,72.39 15.88,75.57 15.88,80.01 15.24,80.01 | 15.24,80.01 13.97,80.01 CAN_2_O.1 15.24,80.01 | v17.14,68.58 13.97,68.58 CAN_2_I.1 | 19.05,72.39 v18.41,71.76
  Bottom 0.203: v17.14,68.58 18.41,69.85 v18.41,71.76
CAN_L
  Top 0.203: MCP2562FD.CANL 24.76,45.09 24.13,45.72 16.51,45.72 15.88,46.35 13.97,46.35 CAN_FD_I.2 13.34,46.99 13.34,56.52 11.43,56.52 10.79,57.15 10.79,59.05 13.34,59.05 CAN_FD_O.2 13.97,59.69 15.88,59.69 16.51,60.32 24.76,60.32 | 24.76,60.32 24.76,62.23 J2_FD.2 | 24.76,60.32 24.76,59.69 D3.2
CAN_L1
  Top 0.203: MCP2562.CANL 24.76,71.12 24.76,69.85 16.51,69.85 15.88,70.48 13.97,70.48 CAN_2_I.2 13.34,71.12 13.34,79.38 11.43,79.38 10.79,80.01 10.79,81.92 13.34,81.92 CAN_2_O.2 13.97,82.55 15.88,82.55 16.51,83.19 24.76,83.19 | 24.76,83.19 24.76,85.09 J3_2.2 | 24.76,83.19 24.76,82.55 D5.2
CAN_RX2  (via drill 0.51)
  Top 0.203: v18.41,68.58 26.04,68.58 26.04,66.04 MCP2562.RXD
  Bottom 0.203: v18.41,68.58 4.45,54.61 4.45,21.59 8.26,17.78 11.43,17.78 U1.0
CAN_RX3  (via drill 0.51)
  Top 0.203: v45.72,38.73 45.09,38.1 26.67,38.1 26.04,38.73 MCP2562FD.RXD | v52.71,21.59 53.98,20.32 60.33,20.32 61.59,19.05 U1.30
  Bottom 0.203: v45.72,38.73 48.26,36.2 48.26,33.66 52.71,29.21 v52.71,21.59
CAN_TX2  (via drill 0.51)
  Top 0.203: v22.22,64.14 22.22,65.41 MCP2562.TXD
  Bottom 0.203: v22.22,64.14 12.7,54.61 12.7,20.95 13.97,19.68 U1.1
CAN_TX3  (via drill 0.51)
  Top 0.203: v19.05,37.46 20.95,37.46 22.22,38.73 MCP2562FD.TXD | v17.78,29.84 22.22,25.4 57.79,25.4 64.14,19.05 U1.31
  Bottom 0.203: v19.05,37.46 17.78,36.2 v17.78,29.84
GND_MCU  (via drill 0.51)
  Top 0.203: J1.1 38.1,43.81 v44.45,43.81 49.53,43.81 50.8,42.55 | 50.8,42.55 51.44,41.91 J4.1 | U1.GND4 53.98,27.3 52.07,27.3 45.09,34.29 U1.GND2 44.45,33.02 25.4,33.02 | 22.22,43.18 23.49,41.91 23.49,39.37 MCP2562FD.VSS | 22.22,43.18 22.22,44.45 MCP2562FD.STBY | 25.4,33.02 25.4,31.11 24.13,29.84 U1.GND5 | 13.34,33.02 25.4,33.02 | 13.34,33.02 12.07,34.29 U1.GND3 | U1.GND1 8.89,33.02 13.34,33.02 | 22.22,43.18 16.51,37.46 v11.43,37.46 | CONN03.12 22.86,11.43 29.21,11.43 29.84,12.07 41.91,12.07 | 41.91,12.07 43.18,10.8 CONN01.12 | 41.91,12.07 61.59,12.07 J2.10 64.14,10.8 64.77,10.8 65.41,10.16 J2.12 70.48,14.61 70.48,43.81 | S2.S2 S1.S2 70.48,59.69 70.48,43.81 | C6.2 25.4,53.98 27.94,53.98 C5.2 27.94,54.61 27.94,56.52 | 27.94,56.52 27.94,62.23 26.04,64.14 24.76,64.14 23.49,65.41 MCP2562.VSS 23.49,66.04 v23.49,67.31 | 27.94,56.52 23.49,56.52 23.49,58.42 D3.3 | D5.3 22.86,81.28 22.86,78.74 C4.2 22.86,78.11 22.22,78.11 v21.59,77.47 | v20.95,71.12 22.22,71.12 MCP2562.STBY | 38.1,78.74 S4.S2 S3.S2 | 38.1,78.74 34.92,78.74 | 34.92,78.74 27.94,78.74 C10.2 | 34.92,78.74 34.92,85.09 OUT_LED_3.2 | 38.1,78.74 44.45,85.09 OUT_LED_4.2 | 50.8,42.55 52.07,43.81 70.48,43.81
  Bottom 0.203: U1.GND2 v44.45,43.81 | U1.GND3 v11.43,37.46 | S4.S2 41.91,80.01 26.04,80.01 23.49,77.47 v21.59,77.47 21.59,71.76 v20.95,71.12 20.95,69.85 v23.49,67.31 | S1.S2 61.59,60.32 61.59,78.11 S3.S2
GPIO_01
  Bottom 0.203: U1.2 15.24,19.05 15.24,18.41 6.98,10.16 6.98,8.89 8.26,7.62 CONN03.1
GPIO_02
  Bottom 0.203: U1.3 17.78,19.05 17.78,16.51 12.7,11.43 12.7,8.89 12.07,8.25 11.43,8.25 CONN03.3
GPIO_03
  Bottom 0.203: U1.4 21.59,17.78 15.24,11.43 15.24,8.89 14.61,8.25 13.97,8.25 CONN03.5
GPIO_04
  Bottom 0.203: U1.5 23.49,18.41 23.49,17.14 17.78,11.43 17.78,8.89 17.14,8.25 16.51,8.25 CONN03.7
GPIO_05
  Top 0.203: U1.6 26.67,17.78 26.04,17.78 21.59,13.34 11.43,13.34 8.89,10.8 CONN03.2
GPIO_06
  Top 0.203: U1.7 28.57,18.41 27.94,18.41 22.22,12.7 13.34,12.7 11.43,10.8 CONN03.4
GPIO_07  (via drill 0.51)
  Top 0.203: U1.8 31.75,20.32 26.04,20.32 25.4,19.68 25.4,17.78 v20.32,17.78
  Bottom 0.203: v20.32,17.78 14.61,12.07 14.61,11.43 13.97,10.8 CONN03.6
GPIO_08  (via drill 0.51)
  Top 0.203: U1.9 34.29,20.95 26.04,20.95 25.4,20.32 v22.86,20.32
  Bottom 0.203: v22.86,20.32 22.86,17.14 16.51,10.8 CONN03.8
GPIO_09
  Top 0.203: U1.10 36.83,17.78 27.94,17.78 22.22,12.07 20.32,12.07 19.05,10.8 CONN03.10
GPIO_10  (via drill 0.51)
  Top 0.203: U1.11 39.37,17.14 33.02,17.14 v28.57,12.7
  Bottom 0.203: v28.57,12.7 28.57,8.89 29.84,7.62 CONN01.1
GPIO_11  (via drill 0.51)
  Top 0.203: U1.12 41.91,15.88 v36.83,15.88
  Bottom 0.203: v36.83,15.88 34.29,13.34 34.29,8.89 33.66,8.25 33.02,8.25 CONN01.3
GPIO_12
  Bottom 0.203: U1.20 38.1,20.32 38.1,13.97 38.73,13.34 38.73,12.7 36.83,10.8 36.83,8.89 36.2,8.25 35.56,8.25 CONN01.5
GPIO_13
  Bottom 0.203: U1.21 22.86,34.29 22.86,34.92 23.49,35.56 25.4,35.56 25.4,33.66 38.73,20.32 40.64,20.32 40.64,12.7 39.37,11.43 39.37,8.89 38.73,8.25 38.1,8.25 CONN01.7
GPIO_14
  Bottom 0.203: U1.22 20.32,33.02 20.32,26.67 24.13,22.86 24.13,20.95 25.4,19.68 25.4,17.78 29.84,13.34 29.84,11.43 30.48,10.8 CONN01.2
GPIO_15
  Bottom 0.203: U1.23 17.14,34.92 17.14,36.83 19.05,38.73 20.32,38.73 20.32,33.66 20.95,33.02 24.76,33.02 33.02,24.77 CONN01.4
GPIO_16  (via drill 0.51)
  Top 0.203: U1.24 46.99,15.24 39.37,15.24 v37.47,13.34
  Bottom 0.203: v37.47,13.34 36.2,12.07 36.2,11.43 35.56,10.8 CONN01.6
GPIO_17  (via drill 0.51)
  Top 0.203: v49.53,10.8 47.62,8.89 39.37,8.89 38.73,9.53 38.73,10.16 CONN01.8
  Bottom 0.203: v49.53,10.8 U1.25
GPIO_18  (via drill 0.51)
  Top 0.203: U1.26 52.07,13.97 v43.18,13.97
  Bottom 0.203: v43.18,13.97 41.28,12.07 41.28,11.43 40.64,10.8 CONN01.10
GPIO_19
  Bottom 0.203: U1.27 54.61,8.89 53.98,8.25 53.34,8.25 J2.1
GPIO_20
  Bottom 0.203: U1.38 55.88,34.29 55.88,12.7 57.15,11.43 57.15,8.89 56.52,8.25 55.88,8.25 J2.3
GPIO_21  (via drill 0.51)
  Top 0.203: U1.39 52.07,27.94 v57.15,27.94
  Bottom 0.203: v57.15,27.94 58.42,26.67 58.42,12.7 59.69,11.43 59.69,8.89 59.05,8.25 58.42,8.25 J2.5
GPIO_22
  Bottom 0.203: U1.40 50.8,34.29 50.8,34.92 51.44,35.56 63.5,35.56 63.5,12.7 62.23,11.43 62.23,8.89 61.59,8.25 60.96,8.25 J2.7
GPIO_23
  Bottom 0.203: U1.41 50.8,30.48 50.8,13.34 53.34,10.8 J2.2
GPIO_24
  Bottom 0.203: U1.13 42.55,33.66 42.55,25.4 48.26,19.68 48.26,10.8 53.34,5.71 54.61,5.71 54.61,8.25 55.88,9.53 J2.4
GPIO_25
  Bottom 0.203: U1.33 70.48,34.29 70.48,6.99 66.67,3.17 57.15,3.17 57.15,8.25 58.42,9.53 J2.6
GPIO_26
  Bottom 0.203: U1.36 60.33,33.66 60.33,20.32 60.96,19.68 J2.8
GPIO_27  (via drill 0.51)
  Top 0.203: v40.01,40.01 40.01,41.91 J1.3 | v41.91,36.2 42.55,35.56 55.25,35.56 56.52,34.29 U1.37
  Bottom 0.203: v40.01,40.01 41.91,38.1 v41.91,36.2
GPIO_28  (via drill 0.51)
  Top 0.203: v41.28,40.01 41.28,41.91 J1.4 | v49.53,22.22 51.44,20.32 52.71,20.32 53.34,19.68 53.34,17.78 55.25,17.78 56.52,19.05 U1.28
  Bottom 0.203: v41.28,40.01 43.18,38.1 43.18,28.57 v49.53,22.22
GPIO_29
  Top 0.203: U1.29 60.33,19.05 61.59,17.78 66.04,17.78 66.04,19.68 59.69,26.04 58.42,26.04 58.42,34.92 55.88,37.46 53.98,37.46 53.98,41.91 J4.3
GPIO_30
  Top 0.203: U1.34 64.77,36.2 57.79,43.18 55.25,43.18 55.25,41.91 J4.4
GPIO_31
  Top 0.203: U1.35 61.59,34.29 57.79,38.1 55.88,38.1 55.88,41.91 J4.5
GPIO_32
  Top 0.203: U1.32 67.31,22.86 63.5,26.67 63.5,36.83 59.05,41.27 57.79,41.27 57.15,41.91 J4.6
KEY_01  (via drill 0.51)
  Top 0.203: v22.22,50.16 20.32,48.26 R1.1 | v26.67,36.2 27.3,35.56 32.38,35.56 33.66,34.29 U1.16 | S1.S1 53.98,56.52 50.16,56.52 36.83,43.18 v35.56,43.18
  Bottom 0.203: v22.22,50.16 26.67,45.72 v26.67,36.2 | v35.56,43.18 34.29,41.91 U1.16
KEY_02
  Top 0.203: S2.S1 34.29,57.15 34.29,71.12 30.48,74.93 27.94,74.93 26.67,73.66 R2.1
  Bottom 0.203: U1.17 32.38,34.92 32.38,54.61 34.92,57.15 S2.S1
KEY_03  (via drill 0.51)
  Top 0.203: v29.21,43.18 29.21,46.35 | 29.21,46.35 29.21,48.26 R3.1 | S3.S1 53.98,75.57 53.34,75.57 39.37,61.59 39.37,57.78 40.01,57.78 42.55,55.24 42.55,51.44 35.56,51.44 30.48,46.35 29.21,46.35
  Bottom 0.203: U1.18 v29.21,43.18
KEY_04
  Top 0.203: S4.S1 34.92,75.57 22.22,75.57 20.32,73.66 R4.1
  Bottom 0.203: U1.19 27.94,34.29 27.94,64.77 36.2,73.03 36.2,75.57 S4.S1
LED_15  (via drill 0.51)
  Top 0.203: v55.25,80.01 57.15,80.01 62.23,85.09 OUT_LED_R4.2
  Bottom 0.203: v55.25,80.01 46.36,71.12 46.36,52.7 35.56,41.91 35.56,38.73 39.37,34.92 U1.14
LED_16  (via drill 0.51)
  Top 0.203: v52.07,84.46 52.71,84.46 53.34,85.09 OUT_LED_R3.2
  Bottom 0.203: v52.07,84.46 42.55,74.93 42.55,67.31 30.48,55.24 30.48,33.66 31.11,33.02 36.83,33.02 U1.15
N$1
  pour Top: 11.43,91.44 66.04,91.44 arc-90 72.39,85.09 72.39,7.62 arc-90 66.04,1.27 8.89,1.27 arc-90 2.54,7.62 2.54,82.55 arc-90
  pour Bottom: 11.43,91.44 66.04,91.44 arc-90 72.39,85.09 72.39,7.62 arc-90 66.04,1.27 8.89,1.27 arc-90 2.54,7.62 2.54,82.55 arc-90
N$2  (via drill 0.51)
  Top 0.203: v22.86,55.88 22.86,54.61 R8.2
  Bottom 0.203: v22.86,55.88 22.22,56.52 22.22,60.96 22.86,61.59 J2_FD.1
N$5
  Top 0.203: J3_2.1 22.86,85.73 24.13,87 27.3,87 27.3,80.65 25.4,78.74 R5.2
N$6
  Top 0.203: OUT_LED_3.1 31.75,85.09 31.75,89.54 45.72,89.54 50.16,85.09 OUT_LED_R3.1
N$7
  Top 0.203: OUT_LED_4.1 41.91,85.09 43.82,87 45.72,87 49.53,83.19 57.15,83.19 59.05,85.09 OUT_LED_R4.1
USB_GND
  Top 0.203: U1.USB_GND1 22.86,22.22 25.4,22.22 U1.USB_GND2
VCC_5V  (via drill 0.51)
  Top 0.35: J2.11 61.59,3.17 43.18,3.17 v42.55,3.81 41.91,3.17 8.26,3.17 4.45,6.99 4.45,35.56 10.16,35.56 | v24.13,76.84 22.86,76.84 C4.1 | v26.67,76.84 27.94,76.84 C10.1 | v24.76,67.31 24.76,66.04 MCP2562.VDD | 23.49,37.46 21.59,35.56 10.16,35.56 | 23.49,37.46 24.76,38.73 MCP2562FD.VDD | U1.VIN 10.16,35.56 | 23.49,37.46 53.34,37.46 53.34,41.91 J4.2
  Bottom 0.35: CONN03.11 26.04,3.17 42.55,3.17 v42.55,3.81 42.55,6.35 43.18,6.99 CONN01.11 | v26.67,76.84 24.76,76.84 | 24.76,76.84 v24.13,76.84 | 24.76,76.84 v24.76,67.31 22.86,65.41 16.51,65.41 16.51,59.69 8.89,52.07 U1.VIN